# EAGLE design 14A-05 (EAGLE 6.3)
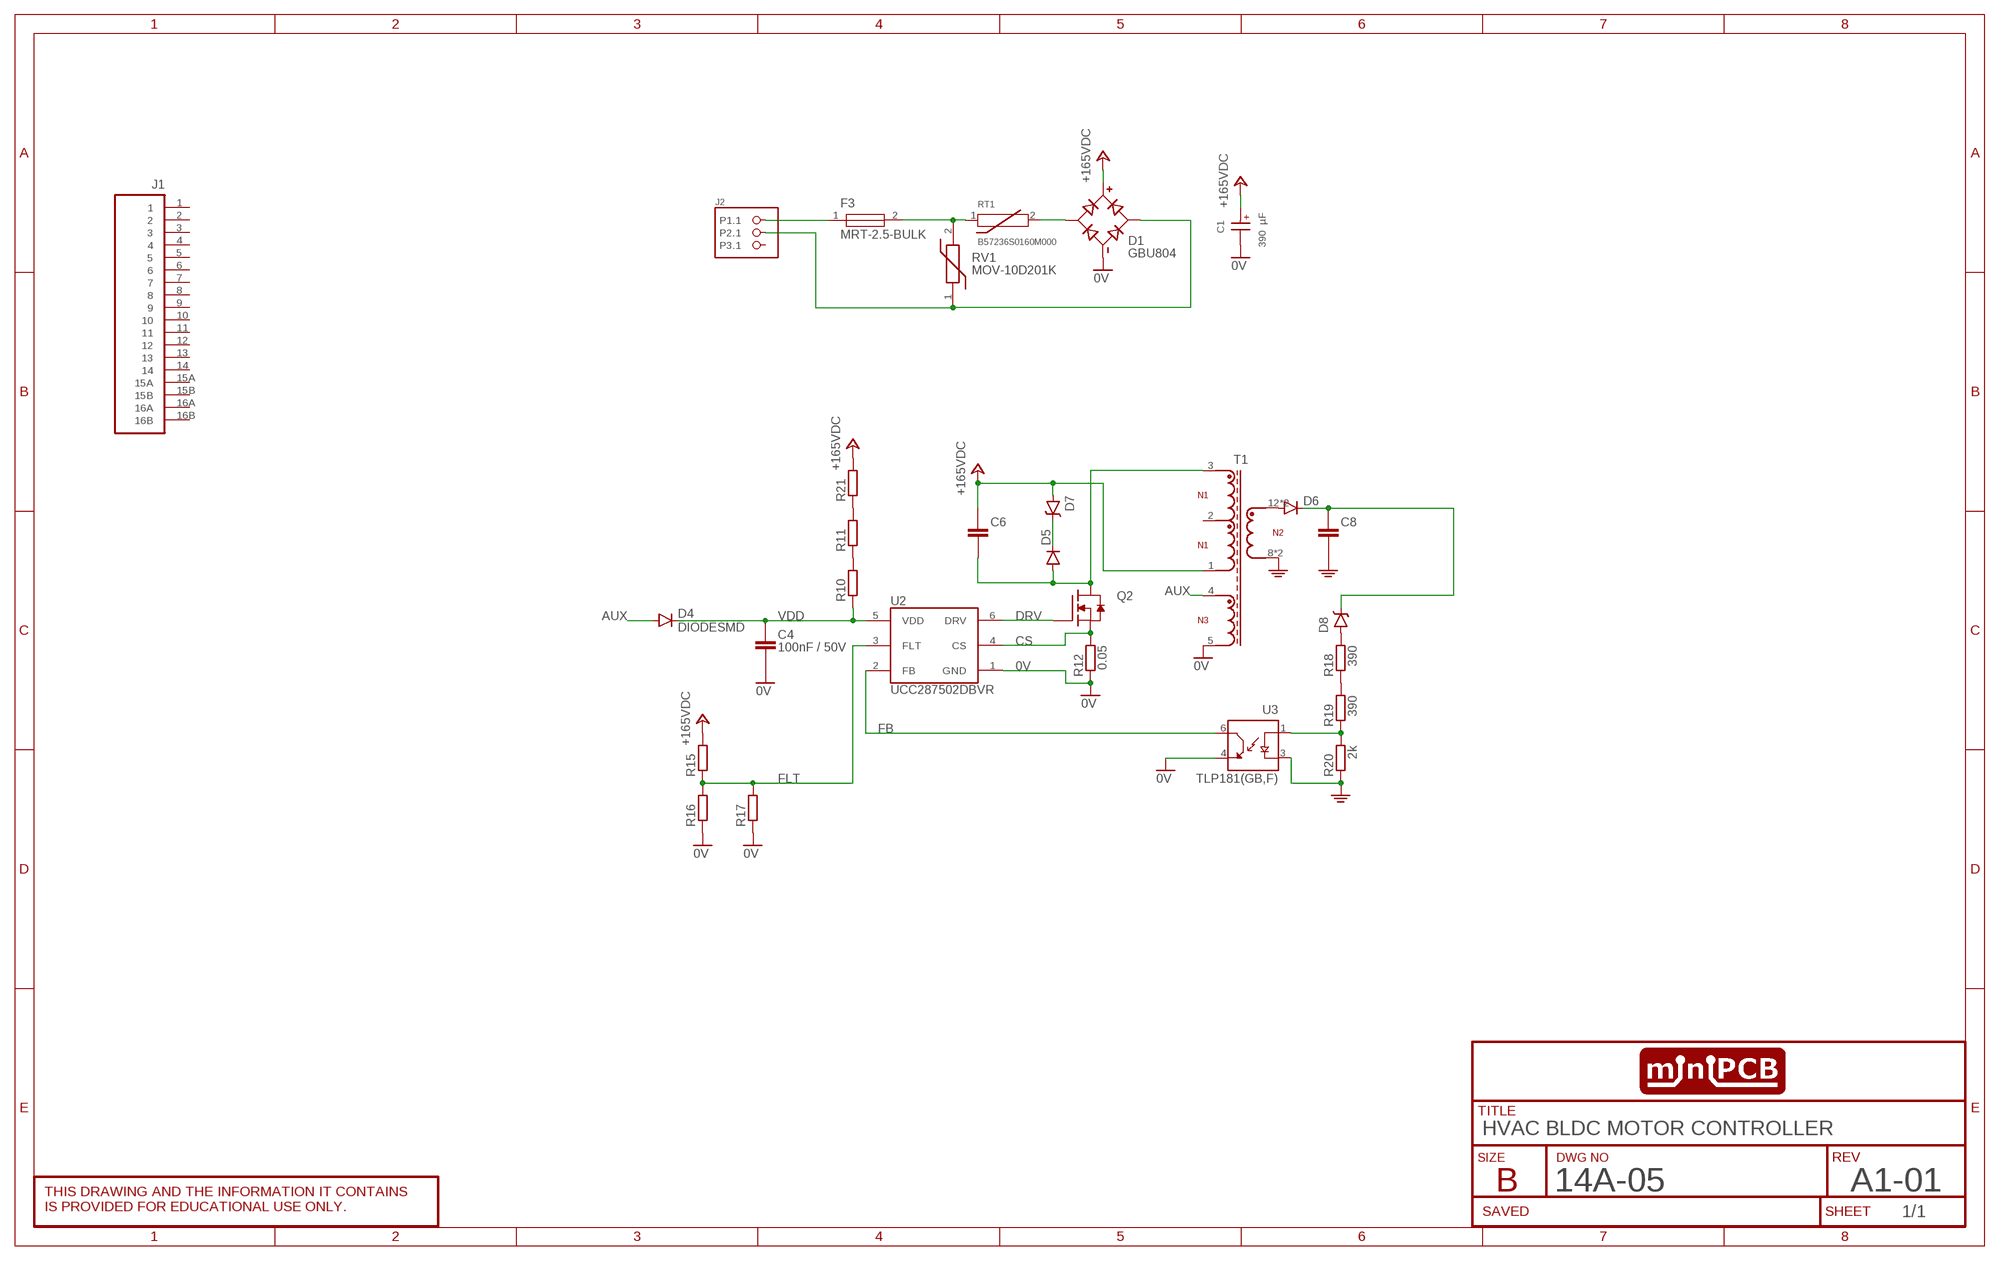
[diagram p0: schematic, sheet 1]
SHEET1 (SCHEMATIC): DWG_NO: 14A-05; REV: A1-01; TITLE: HVAC BLDC MOTOR CONTROLLER

## Parts
C1  390 µF  WCAP-AIE8_30X45_861221485018  [WCAP-AIE8_30X45(DXL)]
C4  100nF / 50V  CAPACITORSMD  [C0805]
C6  CAPACITORSMD  [C0805]
C8  CAPACITOR3.5MM  [C3-5MM]
D1  GBU804  [SIP343W114P508L2205H2134Q4]
D4  DIODESMD  [DO214AC]
D5  DIODESMD  [DO214AC]
D6  DIODESMD  [DO214AC]
D7  ZENERSOD80C  [SOD80C]
D8  ZENERSOD80C  [SOD80C]
F3  MRT-2.5-BULK  [FUSE_MRT-2.5-BULK]
J1  BC_HOUSING_107.6MM  [BC_HOUSING_107MM]
J2  2604-3103  [P-2604-3103]
Q2  MOSFET-NDPAK  [DPACK]
R10  RESISTORSMD  [R0805]
R11  RESISTORSMD  [R0805]
R12  0.05  RESISTOR2512  [R2512K]
R15  RESISTORSMD  [R0805]
R16  RESISTORSMD  [R0805]
R17  RESISTORSMD  [R0805]
R18  390  RESISTORSMD  [R0805]
R19  390  RESISTORSMD  [R0805]
R20  2k  RESISTORSMD  [R0805]
R21  RESISTORSMD  [R0805]
RT1  B57236S0160M000  [THRMRB500W60L1150T500H1600]
RV1  MOV-10D201K  [MOV10D201KTR]
T1  TRANSFORMER-FLYBACK  [750342415]
U2  UCC287502DBVR  [SOT23-6]
U3  TLP181(GB,F)  [SOIC254P700X280-4N]

## Nets
0V: C1.2(-) C4.2ASDF(-) D1.- R12.1 R16.1 R17.1 T1.5 U2.1(GND) U3.4(ET)
+24V: C1.1(+) C6.1ASD(+) D1.+ D7.A R15.2 R21.2 T1.1 ; supply symbol labelled +165VDC
AUX: D4.A T1.4
CS: Q2.3(S) R12.2 U2.4(CS)
DRV: Q2.1(G) U2.6(DRV)
FB: U2.2(FB) U3.6(CT)
FLT: R15.1 R16.2 R17.2 U2.3(FLT)
GND: C8.- R20.1 T1.8(8,9) T1.9(8,9) U3.3(C)
N$3: F3.2 RT1.1 RV1.2
N$4: D1.AC1 J2.P2.1 J2.P2.2(P2.1) RV1.1
N$5: D1.AC2 RT1.2
N$14: F3.1 J2.P1.1 J2.P1.2(P1.1)
N$15: R10.2 R11.1
N$20: C6.2ASDF(-) D5.A Q2.4(D) T1.3
N$23: R19.1 R20.2 U3.1(A)
N$24: D6.A T1.12(12,13) T1.13(12,13)
N$25: R18.1 R19.2
N$26: D8.A R18.2
N$29: D5.C D7.C
N$30: C8.+ D6.C D8.C
N$31: R11.2 R21.1
VDD: C4.1ASD(+) D4.C R10.1 U2.5(VDD)
Unconnected: J1.1 J1.2 J1.3 J1.4 J1.5 J1.6 J1.7 J1.8 J1.9 J1.10 J1.11 J1.12 J1.13 J1.14 J1.15A J1.15B J1.16A J1.16B J2.P3.1 J2.P3.2(P3.1) T1.2

## Library data of the parts
C1 = Eagle_WCAP-AIE8 (rev20a):WCAP-AIE8_30X45: WCAP-AIE8 Aluminum Electrolytic Capacitors Long Life +85 °C Characteristics Long life product series Mounting style: Snap-In Capacitance range: 68 µF ‒ 6800 µF Capacitance tolerance: ±20 % Voltage range (UR): 63 ‒ 450 V(DC) Operating temperature: -40 °C up to +85 °C for UR ≤ 100 V(DC) -25 °C up to +85 °C for UR > 100 V(DC) Endurance: 3000 h @ +85 °C Dimensions (DxL) in mm: 22.0 x 25.0 up to 35.0 x 50.0 Recommended soldering: Wave soldering Applications Long life applications (industry, medical) Filtering Smoothing Energy storage e.g. Personal and industrial computer power supply, server power supply, drive circuit, DC/AC inverter DXL=DiameterxLength <https://www.we-online.com/catalog/media/o14718v209%20Family_WCAP-AIE8.jpg> Details see: https://www.we-online.com/catalog/en/WCAP-AIE8/ Updated by yingchun,Shan;2020-03-04 2020(C) Würth Elektronik; DATASHEET-URL: https://www.we-online.com/catalog/datasheet/861221485018.pdf; DF: 20%; DIAMETER: 30mm; I-LEAK: 1256.78uA; I-RIPPLE: 2350mA; L: 45mm; OPERATING-TEMPERATURE: -25 °C up to +85 °C; PART-NUMBER: 861221485018; PITCH: 10mm; TECHNICAL-REFERENCE: ANAP450391M450DSIC2C000; VR: 450V(DC)
C4 C6 C8 = minipcb:CAPACITOR
D1 = GBU804:GBU804: Check availability <https://pricing.snapeda.com/parts/GBU804/Taiwan%20Semiconductor/view-part?ref=eda>; AVAILABILITY: In Stock; CHECK_PRICES: https://www.snapeda.com/parts/GBU804/Taiwan+Semiconductor/view-part/?ref=eda; DESCRIPTION: 8A, 400V, Standard Bridge Rectifier; MF: Taiwan Semiconductor; MP: GBU804; PACKAGE: GBU Taiwan Semiconductor; PRICE: None; SNAPEDA_LINK: https://www.snapeda.com/parts/GBU804/Taiwan+Semiconductor/view-part/?ref=snap
D4-D6 = minipcb:DIODE
D7 D8 = minipcb:ZENER: Z-Diode
F3 = MRT-2.5-BULK:MRT-2.5-BULK: MRF 1-BULK (0691-1000-01) | 2-Pin Radial Fuse | Round | Fast Acting | IEC | Bulk Pack | 1A Check availability <https://pricing.snapeda.com/parts/MRT-2.5-BULK/Bel%20Fuse/view-part?ref=eda>; AVAILABILITY: Not in stock; CHECK_PRICES: https://www.snapeda.com/parts/MRT-2.5-BULK/Bel+Fuse/view-part/?ref=eda; DESCRIPTION: MRT 2.5-BULK (0692-2500-01) | 2-Pin Radial Fuse | Round | Time Lag | IEC | Bulk Pack | 2.5A; MF: Bel Fuse; MP: MRT-2.5-BULK; PACKAGE: None; PRICE: None; SNAPEDA_LINK: https://www.snapeda.com/parts/MRT-2.5-BULK/Bel+Fuse/view-part/?ref=snap
J1 = miniPCB_BOARDS:BC_HOUSING
J2 = 2604-3103:2604-3103: Check availability <https://pricing.snapeda.com/parts/2604-3103/WAGO%20Innovative%20Connections/view-part?ref=eda>; AVAILABILITY: In Stock; CHECK_PRICES: https://www.snapeda.com/parts/2604-3103/WAGO/view-part/?ref=eda; DESCRIPTION: 3 Position Wire to Board Terminal Block Vertical with Board 0.197 (5.00mm) Through Hole; MF: WAGO Innovative Connections; MP: 2604-3103; PACKAGE: None; PRICE: None; SNAPEDA_LINK: https://www.snapeda.com/parts/2604-3103/WAGO/view-part/?ref=snap
Q2 = minipcb:MOSFET-N
R10-R12 R15-R21 = minipcb:RESISTOR
RT1 = B57236S0160M000:B57236S0160M000: Check availability <https://pricing.snapeda.com/parts/B57236S0160M000/EPCOS/view-part?ref=eda>; AVAILABILITY: In Stock; CHECK_PRICES: https://www.snapeda.com/parts/B57236S0160M000/EPCOS/view-part/?ref=eda; DESCRIPTION: Thermistor NTC 16 Ohm 20% 2-Pin Radial 2965K Bulk Automotive; MF: EPCOS; MP: B57236S0160M000; PACKAGE: None; PRICE: None; SNAPEDA_LINK: https://www.snapeda.com/parts/B57236S0160M000/EPCOS/view-part/?ref=snap
RV1 = MOV-10D201K:MOV-10D201K: BOURNS - MOV-10D201K - VARISTOR, METAL OXIDE, DISC, 170V Source: Datasheet <https://componentsearchengine.com/Datasheets/1/MOV-10D201K.pdf> Check availability <https://pricing.snapeda.com/parts/MOV-10D201K/Bourns/view-part?ref=eda>; AVAILABILITY: In Stock; CHECK_PRICES: https://www.snapeda.com/parts/MOV-10D201K/Bourns/view-part/?ref=eda; DESCRIPTION: MOV-10D Series Metal Oxide Varistor 600pF 25A, Clamping 240V, Varistor 200V | Bourns MOV-10D201K; MF: Bourns; MP: MOV-10D201K; PACKAGE: Disc-10 Bourns; PRICE: None; SNAPEDA_LINK: https://www.snapeda.com/parts/MOV-10D201K/Bourns/view-part/?ref=snap
T1 = minipcb:TRANSFORMER-FLYBACK
U2 = minipcb:UCC287502DBVR: Current-Mode Flyback Controller with Secondary-Side Regulation (SSR) for Off-Line Applications
U3 = TLP181_GB_F_:TLP181(GB,F): Check availability <https://pricing.snapeda.com/parts/TLP181%28GB%2CF%29/Toshiba/view-part?ref=eda>; AVAILABILITY: In Stock; CHECK_PRICES: https://www.snapeda.com/parts/TLP181(GB,F)/Toshiba/view-part/?ref=eda; DESCRIPTION: Optocouplers/Optoisolators, trans, Optoelectronics, optocoupler; MF: Toshiba; MP: TLP181(GB,F); PACKAGE: SO-4 Toshiba; PRICE: None; SNAPEDA_LINK: https://www.snapeda.com/parts/TLP181(GB,F)/Toshiba/view-part/?ref=snap

## Board
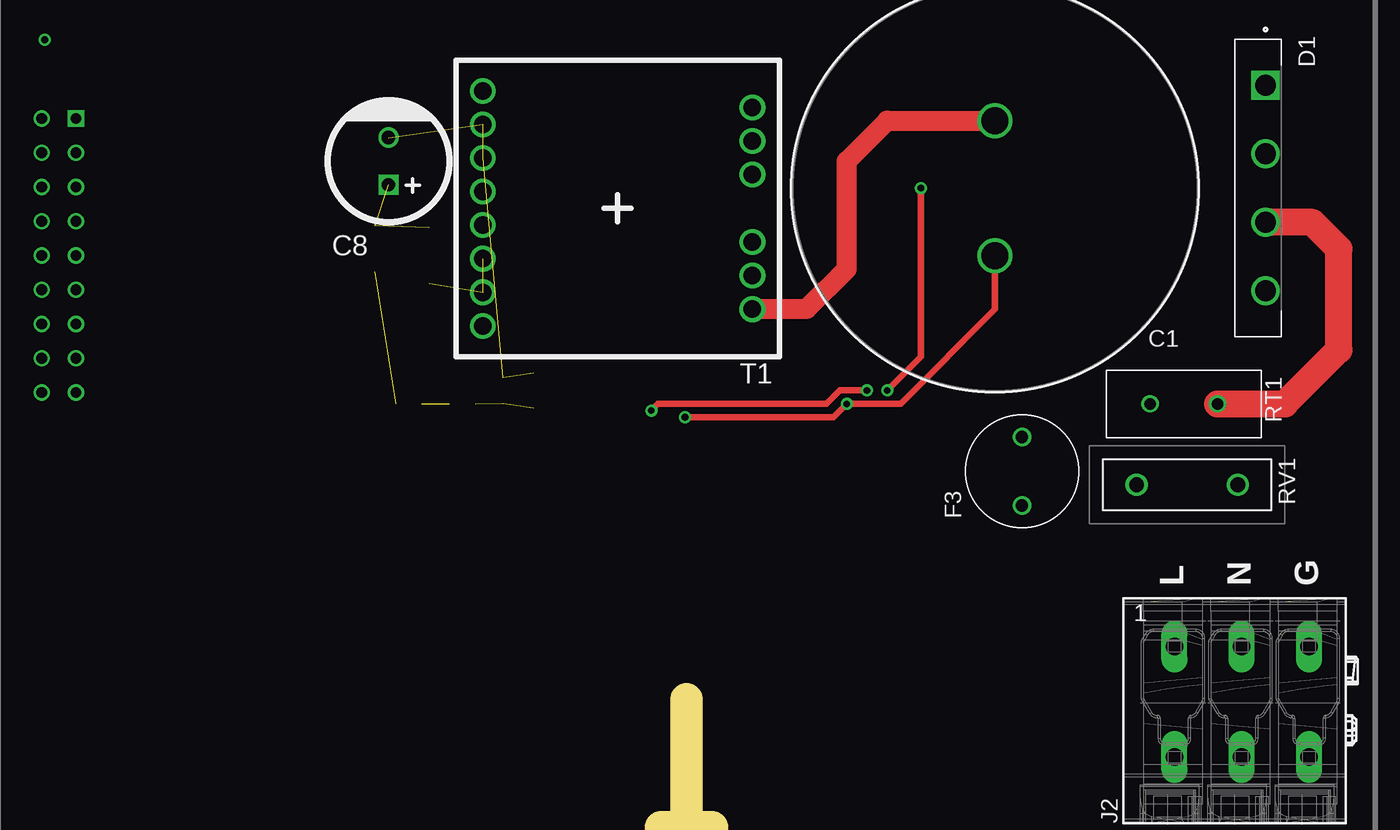
[diagram p1: board, top side]
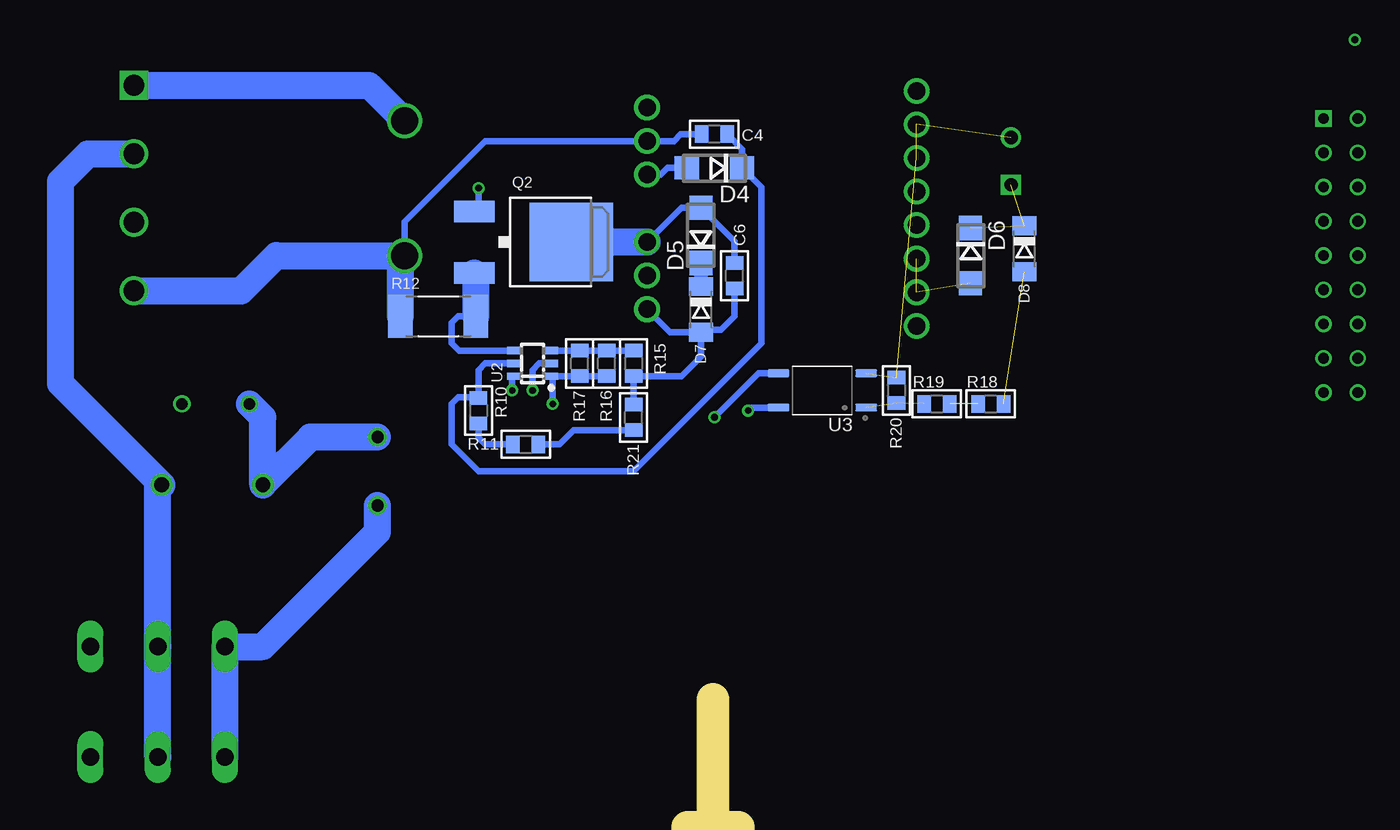
[diagram p2: board, bottom side, seen from below]

No outline drawn. Coordinates in mm, seen from the top.
Copper layers (1+2*15+16): Top 0.035mm / dielectric 0.15mm / Route2 0.035mm / dielectric 0.15mm / Route15 0.035mm / dielectric 0.2mm / Bottom 0.035mm
Design rules "minipcb-SMD": minimum track width 0.25mm, minimum drill 0.5mm, track to track 0.3mm, track to pad 0.3mm, pad to pad 0.15mm, via to via 0.3mm, smd to smd 0.15mm, copper to edge 1mm, drill to drill 1mm, minimum pad ring 0.2mm, minimum via ring 0.2mm, stop-mask expansion 0.1mm, vias tented up to drill 0.55mm, thermal gap 0.5mm

### Footprints (pad centres in the part's own frame; a part is rotated, then mirrored left to right if it is on the bottom)
WCAP-AIE8_30X45(DXL) = drill 2: 1 5,0; 2 -5,0
C0805 = smd 1 x 1.3: 1ASD -0.95,0; 2ASDF 0.95,0
C3-5MM = drill 1 square: + -1.75,0 | drill 1: - 1.75,0
SIP343W114P508L2205H2134Q4 = drill 1.54 square: + -7.62,0.56 | drill 1.54: - 7.62,0.56; AC1 -2.54,0.56; AC2 2.54,0.56
DO214AC = smd 1.8 x 1.7: A 2.05,0; C -2.05,0
SOD80C = smd 1.4 x 1.8: A 1.7,0; C -1.7,0
FUSE_MRT-2.5-BULK = drill 0.9: 1 -2.54,0; 2 2.54,0
BC_HOUSING_107MM = drill 0.8 square: 1 5.82,10.16 | drill 0.8: 2 3.28,10.16; 3 5.82,7.62; 4 3.28,7.62; 5 5.82,5.08; 6 3.28,5.08; 7 5.82,2.54; 8 3.28,2.54; 9 5.82,0; 10 3.28,0; 11 5.82,-2.54; 12 3.28,-2.54; 13 5.82,-5.08; 14 3.28,-5.08; 15A 5.82,-7.62; 15B 3.28,-7.62; 16A 5.82,-10.16; 16B 3.28,-10.16
P-2604-3103 = drill 1.3 pad 1.93 long: P1.1 0,-2.3; P1.2 -8.2,-2.3; P2.1 0,-7.3; P2.2 -8.2,-7.3; P3.1 0,-12.3; P3.2 -8.2,-12.3
DPACK = smd 1.6 x 3: 1 -2.28,-4.8; 3 2.28,-4.8 | smd 5.8 x 6.2: 4 0,2.38
R0805 = smd 1 x 1.3: 1 -0.95,0; 2 0.95,0
R2512K = smd 1.8 x 3.2: 1 -2.8,0; 2 2.8,0
THRMRB500W60L1150T500H1600 = drill 0.85 pad 1.2: 1 -2.5,0; 2 2.5,0
MOV10D201KTR = drill 1.1 pad 1.65: 1 0,0; 2 7.5,0
750342415 = drill 1.3: 1 -10,7.48; 2 -10,4.99; 3 -10,2.5; 4 -10,-2.5; 5 -10,-4.99; 6 -10,-7.48; 7 10,-8.715; 8 10,-6.225; 9 10,-3.735; 10 10,-1.245; 11 10,1.245; 12 10,3.735; 13 10,6.225; 14 10,8.715
SOT23-6 = smd 0.55 x 1.2: 1 -0.95,-1.3; 2 0,-1.3; 3 0.95,-1.3; 4 0.95,1.3; 5 0,1.3; 6 -0.95,1.3
SOIC254P700X280-4N = smd 1.61 x 0.57: 1 -3.25,1.27; 3 -3.25,-1.27; 4 3.25,-1.27; 6 3.25,1.27

### Placement (x,y rotation side)
C1  74,5 90 top
C4  51,9 180 bottom
C6  49.5,-1.5 90 bottom
C8  29,7 90 top
D1  93.5,5 270 top
D4  51,6.5 180 bottom
D5  52,1.5 90 bottom
D6  32,0 270 bottom
D7  52,-4 270 bottom
D8  28,0.5 270 bottom
F3  76,-16 90 top
J1  0,0 0 top
J2  85,-29 90 top
Q2  64,1 270 bottom
R10  68.5,-11.5 270 bottom
R11  65,-14 0 bottom
R12  71.5,-4.5 0 bottom
R15  57,-8 270 bottom
R16  59,-8 90 bottom
R17  61,-8 90 bottom
R18  30.5,-11 0 bottom
R19  34.5,-11 0 bottom
R20  37.5,-10 270 bottom
R21  57,-12 90 bottom
RT1  88,-11 0 top
RV1  92,-17 180 top
T1  46,3.5 180 top
U2  64.5,-8 90 bottom
U3  43,-10 180 bottom

### Tracks (layer width: path | path; a pad name or v marks a point on that pad's centre or on a via)
0V  (via drill 0.5)
  Top 0.5: C1.2 74,-4 67,-11 v63,-11 62,-12 v51,-12
  Bottom 0.5: C4.2ASDF 53.5,9 54.01,8.49 T1.5 68.01,8.49 74,2.5 C1.2 | R16.1 R17.1 U2.1 63,-9.15 v63,-11 | U3.4 47.73,-8.73 v51,-12
  Bottom 2: D1.- 86.12,-2.62 83.5,0 C1.2 arc-90 74.3,-0.3 R12.1
+24V
  Top 1.5: T1.1 60.02,-3.98 63,-1 63,7 66,10 C1.1
  Bottom 0.5: C6.1ASD 49.5,-4.5 50.5,-5.5 51.8,-5.5 D7.A | D7.A 54.28,-5.7 T1.1 | D7.A 52,-7.5 53.45,-8.95 R15.2 R21.2
  Bottom 2: D1.+ 76.62,12.62 C1.1
AUX
  Bottom 0.5: T1.4 55,6 54.5,6.5 D4.A
CS
  Bottom 0.5: R12.2 70,-4.5 70.5,-5 70.5,-6.5 69.95,-7.05 U2.4
  Bottom 2: R12.2 68.7,-1.38 Q2.3
DRV  (via drill 0.5)
  Top 0.5: v66,-10 68.5,-7.5 v68.5,5
  Bottom 0.5: U2.6 66,-9.15 v66,-10 | Q2.1 68.5,3.58 v68.5,5
FB  (via drill 0.5)
  Top 0.5: v48.5,-11.5 49,-11 61.5,-11 62.5,-10 v64.5,-10
  Bottom 0.5: U3.6 48.27,-11.27 v48.5,-11.5 | v64.5,-10 64.5,-8.5 64,-8 U2.2
FLT
  Bottom 0.5: U2.3 R17.2 R16.2 R15.1
GND  (4 unrouted)
N$2  (via drill 0.5)
  other vias: 3.5,16
N$3
  Bottom 2: F3.2 80.96,-13.46 RV1.2 84.5,-12 RT1.1
N$4
  Bottom 2: D1.AC1 97.46,7.54 99.5,5.5 99.5,-9.5 RV1.1 92.3,-17 J2.P2.1 J2.P2.2
N$5
  Top 2: RT1.2 95.5,-11 99.5,-7 99.5,0.5 97.54,2.46 D1.AC2
N$14
  Bottom 2: J2.P1.2 J2.P1.1 84.5,-29 76,-20.5 F3.1
N$15
  Bottom 0.5: R11.1 68,-14 68.5,-13.5 R10.2
N$20
  Bottom 0.5: T1.3 53.45,3.55 D5.A 49.5,1.05 C6.2ASDF
  Bottom 2: T1.3 Q2.4
N$23  (2 unrouted)
N$24  (2 unrouted)
N$25  (1 unrouted)
N$26  (1 unrouted)
N$29
  Bottom 1: D5.C D7.C
N$30  (2 unrouted)
N$31
  Bottom 0.5: R21.1 61.45,-12.95 62.5,-14 R11.2
VDD
  Bottom 0.5: C4.1ASD 48.95,7.9 D4.C 47.5,5.05 47.5,-6.5 57,-16 68.5,-16 70.5,-14 70.5,-11 70,-10.5 68.55,-10.5 R10.1 68.5,-8.5 68,-8 U2.5